# Altium schematic sheet MCU.SchDoc
size A4; SheetNumber: 1; SheetTotal: 1
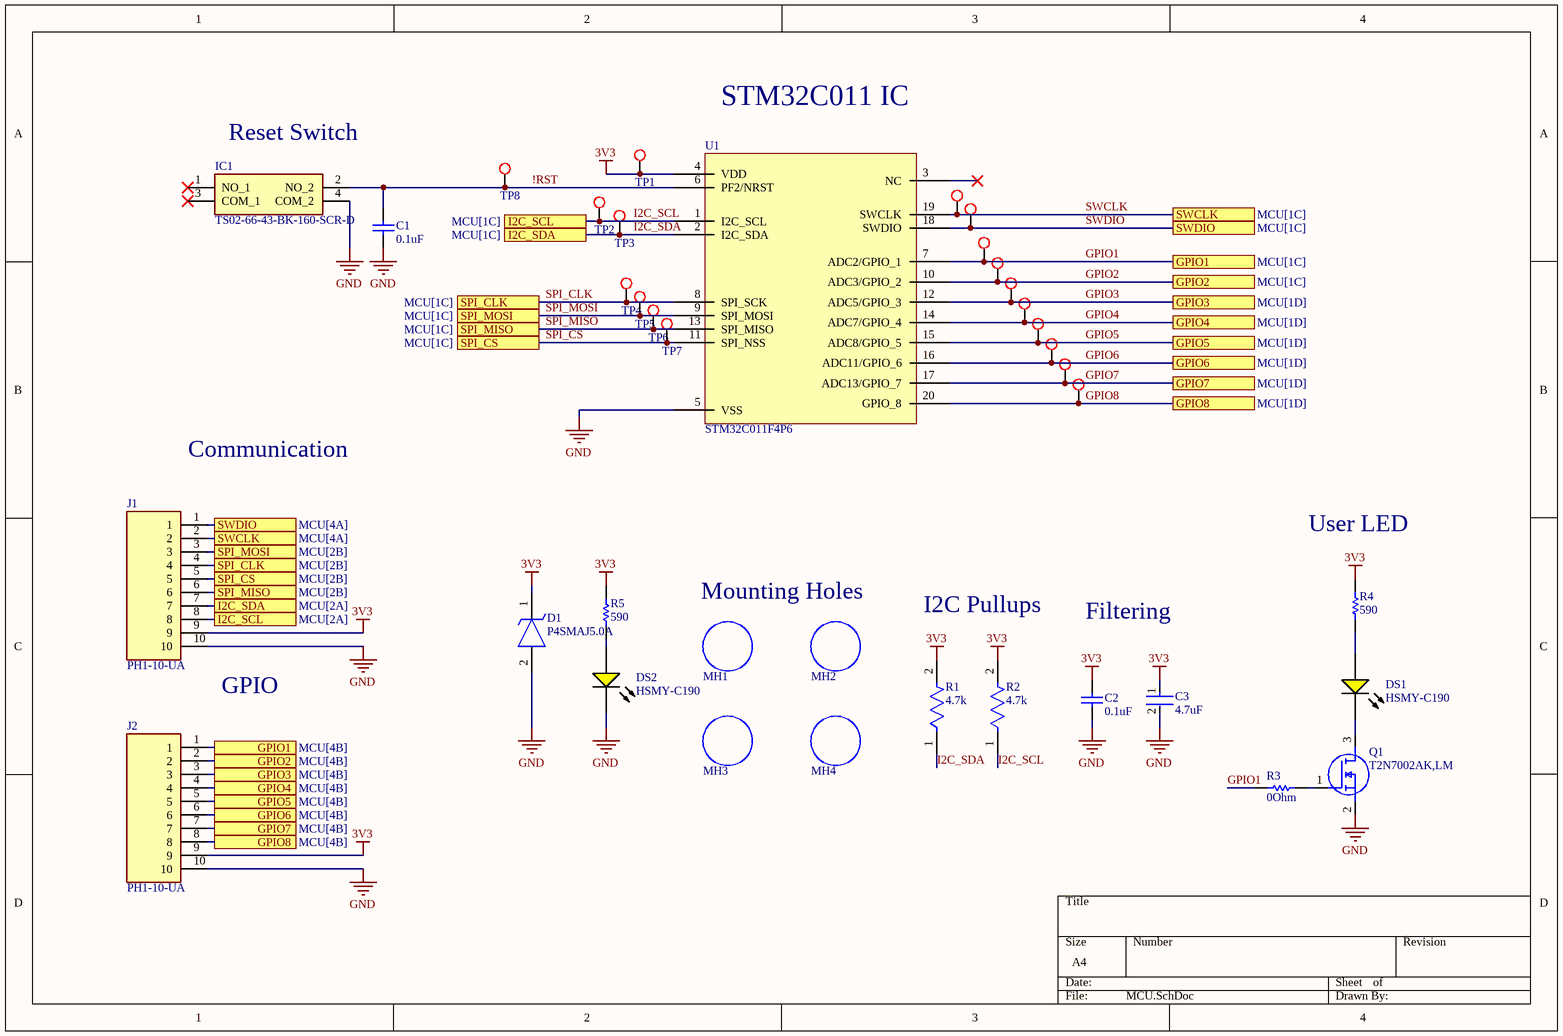
[diagram p0: MCU.SchDoc]

## Parts
C1  0.1uF  [CAPC1608X92X38LL15T08]
C2  0.1uF  [CAPC1608X92X38LL15T08]
C3  4.7uF  [FP-CL10-IPC_A]
D1  P4SMAJ5.0A  [DIOM5027X240N]
DS1  HSMY-C190  [AVAG-HSMX-C190_V]
DS2  HSMY-C190  [AVAG-HSMX-C190_V]
IC1  TS02-66-43-BK-160-SCR-D  [TS026643BK160SCRD]
J1  PH1-10-UA  [HDRV10W64P0X254_1X10_2540X249X886P]
J2  PH1-10-UA  [HDRV10W64P0X254_1X10_2540X249X886P]
MH1  MH?  [Mounting Hole]  (value not drawn)
MH2  MH?  [Mounting Hole]  (value not drawn)
MH3  MH?  [Mounting Hole]  (value not drawn)
MH4  MH?  [Mounting Hole]  (value not drawn)
Q1  T2N7002AK,LM  [TBAT54CLM]
R1  4.7k  [FP-CRCW0603-HPe3-IPC_A]
R2  4.7k  [FP-CRCW0603-HPe3-IPC_A]
R3  0Ohm  [RESC2013X60X35LL10T20]  (no BOM)
R4  590  [RESC1608X55X25ML10T15]
R5  590  [RESC1608X55X25ML10T15]
TP1  TP  [Testpoint]  (value not drawn)
TP2  TP  [Testpoint]  (value not drawn)
TP3  TP  [Testpoint]  (value not drawn)
TP4  TP  [Testpoint]  (value not drawn)
TP5  TP  [Testpoint]  (value not drawn)
TP6  TP  [Testpoint]  (value not drawn)
TP7  TP  [Testpoint]  (value not drawn)
TP8  TP  [Testpoint]  (value not drawn)
TP9  TP  [Testpoint]  (value not drawn)
TP10  TP  [Testpoint]  (value not drawn)
TP11  TP  [Testpoint]  (value not drawn)
TP12  TP  [Testpoint]  (value not drawn)
TP13  TP  [Testpoint]  (value not drawn)
TP14  TP  [Testpoint]  (value not drawn)
TP15  TP  [Testpoint]  (value not drawn)
TP16  TP  [Testpoint]  (value not drawn)
TP17  TP  [Testpoint]  (value not drawn)
TP18  TP  [Testpoint]  (value not drawn)
U1  STM32C011F4P6  [TSSOP20]

## Ports
GPIO1 (see MCU[1C]), GPIO1 (see MCU[4B]), GPIO2 (see MCU[1C]), GPIO2 (see MCU[4B]), GPIO3 (see MCU[1D]), GPIO3 (see MCU[4B]), GPIO4 (see MCU[1D]), GPIO4 (see MCU[4B]), GPIO5 (see MCU[1D]), GPIO5 (see MCU[4B]), GPIO6 (see MCU[1D]), GPIO6 (see MCU[4B]), GPIO7 (see MCU[1D]), GPIO7 (see MCU[4B]), GPIO8 (see MCU[1D]), GPIO8 (see MCU[4B]), I2C_SCL (see MCU[1C]), I2C_SCL (see MCU[2A]), I2C_SDA (see MCU[1C]), I2C_SDA (see MCU[2A]), SPI_CLK (see MCU[1C]), SPI_CLK (see MCU[2B]), SPI_CS (see MCU[1C]), SPI_CS (see MCU[2B]), SPI_MISO (see MCU[1C]), SPI_MISO (see MCU[2B]), SPI_MOSI (see MCU[1C]), SPI_MOSI (see MCU[2B]), SWCLK (see MCU[1C]), SWCLK (see MCU[4A]), SWDIO (see MCU[1C]), SWDIO (see MCU[4A])

## Nets
3V3: C2.2 C3.1 D1.1(K) J1.9 J2.9 R1.2 R2.2 R4.2 R5.2 TP1.0 U1.4(VDD)
GND: C1.1 C2.1 C3.2 D1.2(A) DS2.2(K) IC1.4(COM_2) J1.10 J2.10 Q1.2(S) U1.5(VSS)
!RST: C1.2 IC1.2(NO_2) TP8.0 U1.6(PF2/NRST)
GPIO1: J2.1 R3.2 TP11.0 U1.7(ADC2/GPIO_1) ; port GPIO1
GPIO2: J2.2 TP12.0 U1.10(ADC3/GPIO_2) ; port GPIO2
GPIO3: J2.3 TP13.0 U1.12(ADC5/GPIO_3) ; port GPIO3
GPIO4: J2.4 TP14.0 U1.14(ADC7/GPIO_4) ; port GPIO4
GPIO5: J2.5 TP15.0 U1.15(ADC8/GPIO_5) ; port GPIO5
GPIO6: J2.6 TP16.0 U1.16(ADC11/GPIO_6) ; port GPIO6
GPIO7: J2.7 TP17.0 U1.17(ADC13/GPIO_7) ; port GPIO7
GPIO8: J2.8 TP18.0 U1.20(GPIO_8) ; port GPIO8
I2C_SCL: J1.8 R2.1 TP2.0 U1.1(I2C_SCL) ; port I2C_SCL
I2C_SDA: J1.7 R1.1 TP3.0 U1.2(I2C_SDA) ; port I2C_SDA
SPI_CLK: J1.4 TP4.0 U1.8(SPI_SCK) ; port SPI_CLK
SPI_CS: J1.5 TP7.0 U1.11(SPI_NSS) ; port SPI_CS
SPI_MISO: J1.6 TP6.0 U1.13(SPI_MISO) ; port SPI_MISO
SPI_MOSI: J1.3 TP5.0 U1.9(SPI_MOSI) ; port SPI_MOSI
SWCLK: J1.2 TP9.0 U1.19(SWCLK) ; port SWCLK
SWDIO: J1.1 TP10.0 U1.18(SWDIO) ; port SWDIO
NetDS1_1: DS1.1(A) R4.1
NetDS1_2: DS1.2(K) Q1.3(D)
NetDS2_1: DS2.1(A) R5.1
NetQ1_1: Q1.1(G) R3.1

Not connected (* = marked no-connect by the designer): IC1 1(NO_1)* 3(COM_1)*; U1 3(NC)*

## Notes on the sheet
- STM32C011 IC
- (near IC1) Reset Switch
- Communication
- User LED
- Mounting Holes
- I2C Pullups
- Filtering
- GPIO

## Library data of the parts
C1 C2 = CMP-1035-02583-2: Manufacturer: Vitramon; Part Number: VJ0603Y104JXJAC
C3 = CMP-13271-001817-1: Cap Ceramic 4.7uF 6.3V X6S ±10% Pad SMD 0603 +105°C T/R; Length: 1.6mm; Tolerance: 10%; Packaging: Tape and Reel; Dielectric: X6S; Lead Free: Lead Free; Package Quantity: 1; Case/Package: 0603; Max Operating Temperature: 105°C; Radiation Hardening: No; Thickness: 0.035inch; Depth: 0.8mm; Capacitance: 4.7uF; Case Code (Metric): 1608; Voltage Rating (DC): 6.3V; Height: 0.8mm; Voltage Rating: 6.3V; Mount: Surface Mount; Min Operating Temperature: -55°C; Case Code (Imperial): 0603; Width: 0.031inch
D1 = P4SMAJ5.0A: TVS Diode (Uni-directional); Manufacturer_Name: Diotec; Datasheet Link: https://diotec.com/request/datasheet/p4smaj65.pdf; Height: 2.4mm; Manufacturer_Part_Number: P4SMAJ5.0A
DS1 DS2 = CMP-1744-00003-1: LED Uni-Color Yellow, 65 mW, 20 mA, -40 to 85 degC, 2-Pin SMD, RoHS, Tape and Reel; Tolerance: 1%; Voltage Rating: 50 V; Power Rating: 100 mW; Case\Package: 0603; Resistance: 390 Ohm; Min Operating Temperature: -55 degC; Length: 1.6 mm; ComponentLink3Description: Package Specification; Mount: Surface Mount; PackageReference: HSMX-C190; ComponentLink2Description: Datasheet; DatasheetVersion: Mar-12; Case Code (Metric): 1608; Pins: 2; Package Quantity: 5000; ComponentLink2URL: http://docs.avagotech.com/docs/AV02-0551EN; ComponentLink1Description: Manufacturer URL; RoHSCompliant: true; Packaging: Tape and Reel; PackageDescription: 2-Pin Surface Mount Device, Body 1.6 x 0.8 mm, Height 0.9 mm; REACH SVHC: No SVHC; ComponentLink3URL: http://www.fairchildsemi.com/dwg/MA/MA03D.pdf; Voltage Rating (DC): 50 V; Width: 0.8 mm; ComponentLink1URL: http://www.avagotech.com/; Max Operating Temperature: 155 degC; Case Code (Imperial): 0603; Height: 0.45 mm
IC1 = TS02-66-43-BK-160-SCR-D: Integrated Circuit; Manufacturer_Name: Same Sky; Datasheet Link: https://www.sameskydevices.com/product/resource/supplyframepdf/ts02.pdf; Height: 4.5mm; Manufacturer_Part_Number: TS02-66-43-BK-160-SCR-D; Mouser Part Number: 179-TS026643BK160SCR; Mouser Price/Stock: https://www.mouser.co.uk/ProductDetail/Same-Sky/TS02-66-43-BK-160-SCR-D?qs=A6eO%252BMLsxmTUKKq48hEHkA%3D%3D; Arrow Part Number: TS02-66-43-BK-160-SCR-D; Arrow Price/Stock: https://www.arrow.com/en/products/ts02-66-43-bk-160-scr-d/cui-devices?utm_currency=USD&region=nac
J1 J2 = PH1-10-UA: Connector; Manufacturer_Name: Adam Tech; Datasheet Link: https://app.adam-tech.com/products/download/data_sheet/201605/ph1-xx-ua-data-sheet.pdf; Height: 8.865mm; Manufacturer_Part_Number: PH1-10-UA; Mouser Part Number: 737-PH1-10-UA; Mouser Price/Stock: https://www.mouser.co.uk/ProductDetail/Adam-Tech/PH1-10-UA?qs=ogqIPVdloe%252Bff9mnAAAy9w%3D%3D; Arrow Part Number: PH1-10-UA; Arrow Price/Stock: null?utm_currency=USD&region=nac
MH1-MH4 = Mounting Hole
Q1 = T2N7002AK,LM: MOSFET (N-Channel); Manufacturer_Name: Toshiba; Datasheet Link: http://toshiba.semicon-storage.com/info/docget.jsp?did=29712&prodName=T2N7002AK; Height: 1.1mm; Manufacturer_Part_Number: T2N7002AK,LM; Mouser Part Number: 757-T2N7002AKLM; Mouser Price/Stock: https://www.mouser.co.uk/ProductDetail/Toshiba/T2N7002AKLM?qs=pzVvXTvk9PzfX4hYglwZ9Q%3D%3D; Arrow Part Number: T2N7002AK,LM; Arrow Price/Stock: https://www.arrow.com/en/products/t2n7002aklm/toshiba?utm_currency=USD&region=nac
R1 R2 = CMP-2000-03414-2: RES Thick Film, 4.7kΩ, 5%, 0.33W, 200ppm/°C, 0603; Max Power Dissipation: 250mW; Voltage Rating: 75V; Resistance: 4.7kR; Case/Package: 0603; Lead Free: Lead Free; Tolerance: 5%; Max Operating Temperature: 155°C; RoHS Compliant: Yes; Power Rating: 250mW; Features: Automotive AEC-Q200; Resistor Type: Thick Film; Weight: 7.1E-05oz; Width: 0.033inch; Packaging: Tape and Reel; Case Code (Imperial): 0603; Package Quantity: 1; Contact Plating: Tin; Number of Terminations: 2; Min Operating Temperature: -55°C; Radiation Hardening: No; Case Code (Metric): 1608; Temperature Coefficient: 200ppm/°C; Height: 0.022inch; Length: 0.063inch; Series: CRCW-HP
R3 = CMP-2000-06963-1: Chip Resistor, 0 Ohm, +/- 5%, 125 mW, -55 to 155 degC, 0805 (2012 Metric), RoHS, Tape and Reel; Manufacturer: Yageo; Product Length (mm): 2mm; Tolerance (+ or -): NotRequired; Case Style: Molded; Product Height (mm): 0.5mm; Power Rating(s): NotRequiredW; Product Depth (mm): 1.25mm; Mounting Technology: SurfaceMount; Military Standard: NotRequired; Operating Temp Range: -55Cto155C; Temperature Coefficient: NotRequired; Package Description: 2-Pin Surface Mounted Device, Body 2 x 1.25 mm; Datasheet Version: Rev. 7, 05/2017; Failure Rate: NotRequired; Manufacturer URL: http://www.yageo.com/; Datasheet URL: http://www.yageo.com/documents/recent/PYu-RC_Group_51_RoHS_L_7.pdf; Packaging: TapeandReel; Package Reference: 0805; Package / Case: 0805; Termination Style: NotRequired; Type: ThickFilm; Construction: Rectangular
R4 R5 = CMP-2000-04089-1: Part Number: RC0603FR-07590RL; Manufacturer: Yageo
TP1-TP18 = Testpoint